# Altium schematic sheet I2C Multiplexer.SchDoc: I2C Multiplexer
size A4; DocumentNumber: 50; SheetNumber: 50; SheetTotal: 54
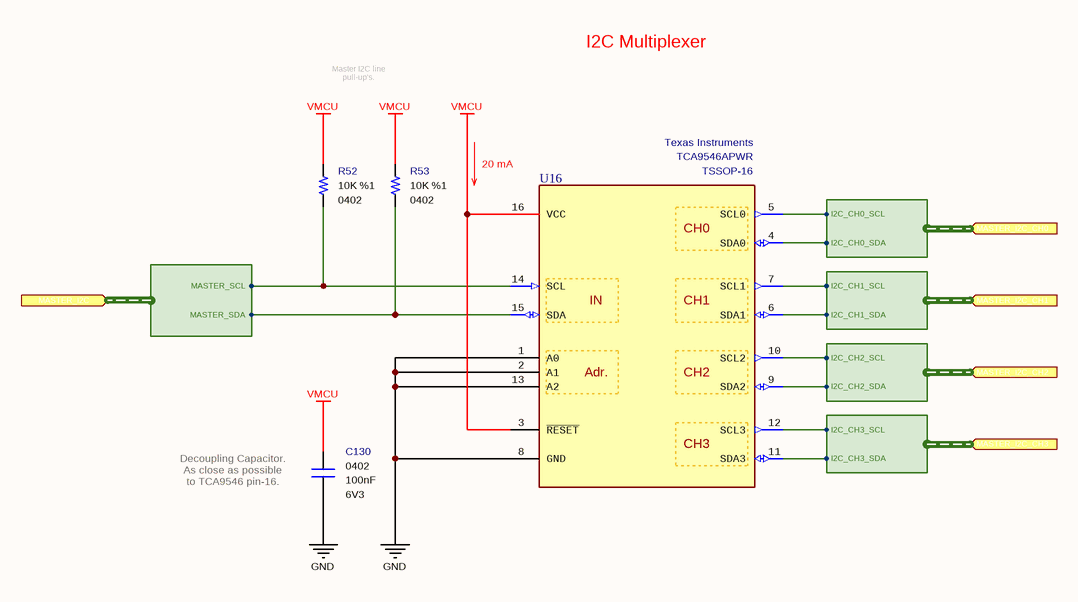
[diagram p0: I2C Multiplexer.SchDoc]

## Parts
C130  value 100nF  Case: 0402  Voltage: 6V3  [CAPACITOR_0402]  (hidden comment: Multilayer Ceramic Capacitor)
R52  value 10K  Tolerance: %1  Case: 0402  [RESISTOR_0402]  (hidden comment: Thick Film Resistor)
R53  value 10K  Tolerance: %1  Case: 0402  [RESISTOR_0402]  (hidden comment: Thick Film Resistor)
U16  Manufacturer Part Number: TCA9546APWR  Manufacturer Name: Texas Instruments  [TSSOP-16]  (hidden comment: I2C Switch IC)

## Ports
MASTER_I2C (in, harness MASTER_I2C), MASTER_I2C_CH0 (in, harness MASTER_I2C_CH0), MASTER_I2C_CH1 (in, harness MASTER_I2C_CH1), MASTER_I2C_CH2 (in, harness MASTER_I2C_CH2), MASTER_I2C_CH3 (in, harness MASTER_I2C_CH3)

## Harnesses
MASTER_I2C: MASTER_SDA, MASTER_SCL
MASTER_I2C_CH0: I2C_CH0_SCL, I2C_CH0_SDA
MASTER_I2C_CH1: I2C_CH1_SCL, I2C_CH1_SDA
MASTER_I2C_CH2: I2C_CH2_SCL, I2C_CH2_SDA
MASTER_I2C_CH3: I2C_CH3_SCL, I2C_CH3_SDA

## Nets
GND: C130.1 U16.1(A0) U16.2(A1) U16.8(GND) U16.13(A2)
VMCU: C130.2 R52.2 R53.2 U16.3(~{RESET}) U16.16(VCC)
NetR52_1: R52.1 U16.14(SCL) ; port MASTER_I2C.MASTER_SCL
NetR53_1: R53.1 U16.15(SDA) ; port MASTER_I2C.MASTER_SDA
NetU16_4: U16.4(SDA0) ; port MASTER_I2C_CH0.I2C_CH0_SDA
NetU16_5: U16.5(SCL0) ; port MASTER_I2C_CH0.I2C_CH0_SCL
NetU16_6: U16.6(SDA1) ; port MASTER_I2C_CH1.I2C_CH1_SDA
NetU16_7: U16.7(SCL1) ; port MASTER_I2C_CH1.I2C_CH1_SCL
NetU16_9: U16.9(SDA2) ; port MASTER_I2C_CH2.I2C_CH2_SDA
NetU16_10: U16.10(SCL2) ; port MASTER_I2C_CH2.I2C_CH2_SCL
NetU16_11: U16.11(SDA3) ; port MASTER_I2C_CH3.I2C_CH3_SDA
NetU16_12: U16.12(SCL3) ; port MASTER_I2C_CH3.I2C_CH3_SCL

## Notes on the sheet
- I2C Multiplexer
- Master I2C line pull-up's.
- (near U16) 20 mA
- (near C130) Decoupling Capacitor. As close as possible to TCA9546 pin-16.
- Engineer
- All Rights are reserved to Customer and Engineer. [2021]
- Size:
- Date:
- A4
- Project :
- Time:
- Sheet
- of
- Customer
- Product ID
- Module ID
- Version
- File:
- Revision
- (in symbol IC - TCA9546APWR) CH0; IN; CH1; Adr.; CH2; CH3

## Library data of the parts
C130 = Capacitor - 100nF [0402-6V3]: Capacitor - 100nF [0402-6V3] (Ceramic); Manufacturer Name: AVX; Manufacturer Part Number: 04026D104KAT4A; Dielectric: X5R; Tolerance: %10; Height: 0.25mm; ComponentLink1Description: Mouser; ComponentLink1URL: https://www.mouser.com.tr/ProductDetail/AVX/04026D104KAT4A?qs=sGAEpiMZZMs0AnBnWHyRQPg4iYkCw7IMED%2F4kpqgf7w%3D; ComponentLink2Description: DataSheet; ComponentLink2URL: https://www.mouser.com.tr/datasheet/2/40/cx5r-776519.pdf; ROHS: Yes; Maximum Operating Temperature: +85; Minimum Operating Temperature: -55; Supplier 1: Avnet; Supplier Part Number 1: 04026D104KAT4A; Mouser Part Number: 581-04026D104KAT4A
R52 R53 = Resistor - 10K: Thick Film Resistors - SMD 1/16 W 10 Kohms 1%; Manufacturer Name: Vishay; Manufacturer Part Number: CRCW040210K0FKED; Height: 0.4mm; ComponentLink1Description: DataSheet; ComponentLink1URL: https://www.mouser.com.tr/datasheet/2/427/dcrcwe3-1762152.pdf; ComponentLink2Description: Mouser; ComponentLink2URL: https://www.mouser.com.tr/ProductDetail/Vishay-Dale/CRCW040210K0FKED?qs=sGAEpiMZZMu61qfTUdNhG2DpbjADlD3GcalbOv9utCY%3D; Supplier 1: Mouser; Supplier 2: Digi-Key; Supplier Part Number 1: 71-CRCW040210K0FKEDH; Supplier Part Number 2: 541-10.0KYCT-ND; Mouser Part Number: 71-CRCW0402-10K-E3
U16 = IC - TCA9546APWR: Switch ICs - Various 4-Channel I2C and SMBus; Mouser Part Number: 595-TCA9546APWR; ComponentLink1Description: DataSheet; ComponentLink1URL: http://www.ti.com/lit/ds/symlink/tca9546a.pdf; ComponentLink2Description: Mouser; ComponentLink2URL: https://eu.mouser.com/ProductDetail/Texas-Instruments/TCA9546APWR?qs=sGAEpiMZZMu0f%252BT2bkVfuqY85%252BzcFu6eZaMCXRqwDMg%3D; Minimum Operating Temperature: -40; Maximum Operating Temperature: +85; Supplier 1: Mouser; Supplier 2: Farnell; Supplier 3: Newark; Supplier 4: Digi-Key; Supplier Part Number 1: 595-TCA9546APWR; Supplier Part Number 2: 3006768; Supplier Part Number 3: 28AH5268; Supplier Part Number 4: 296-40578-1-ND; Case: TSSOP-16